# Altium project EPU.PrjPcb
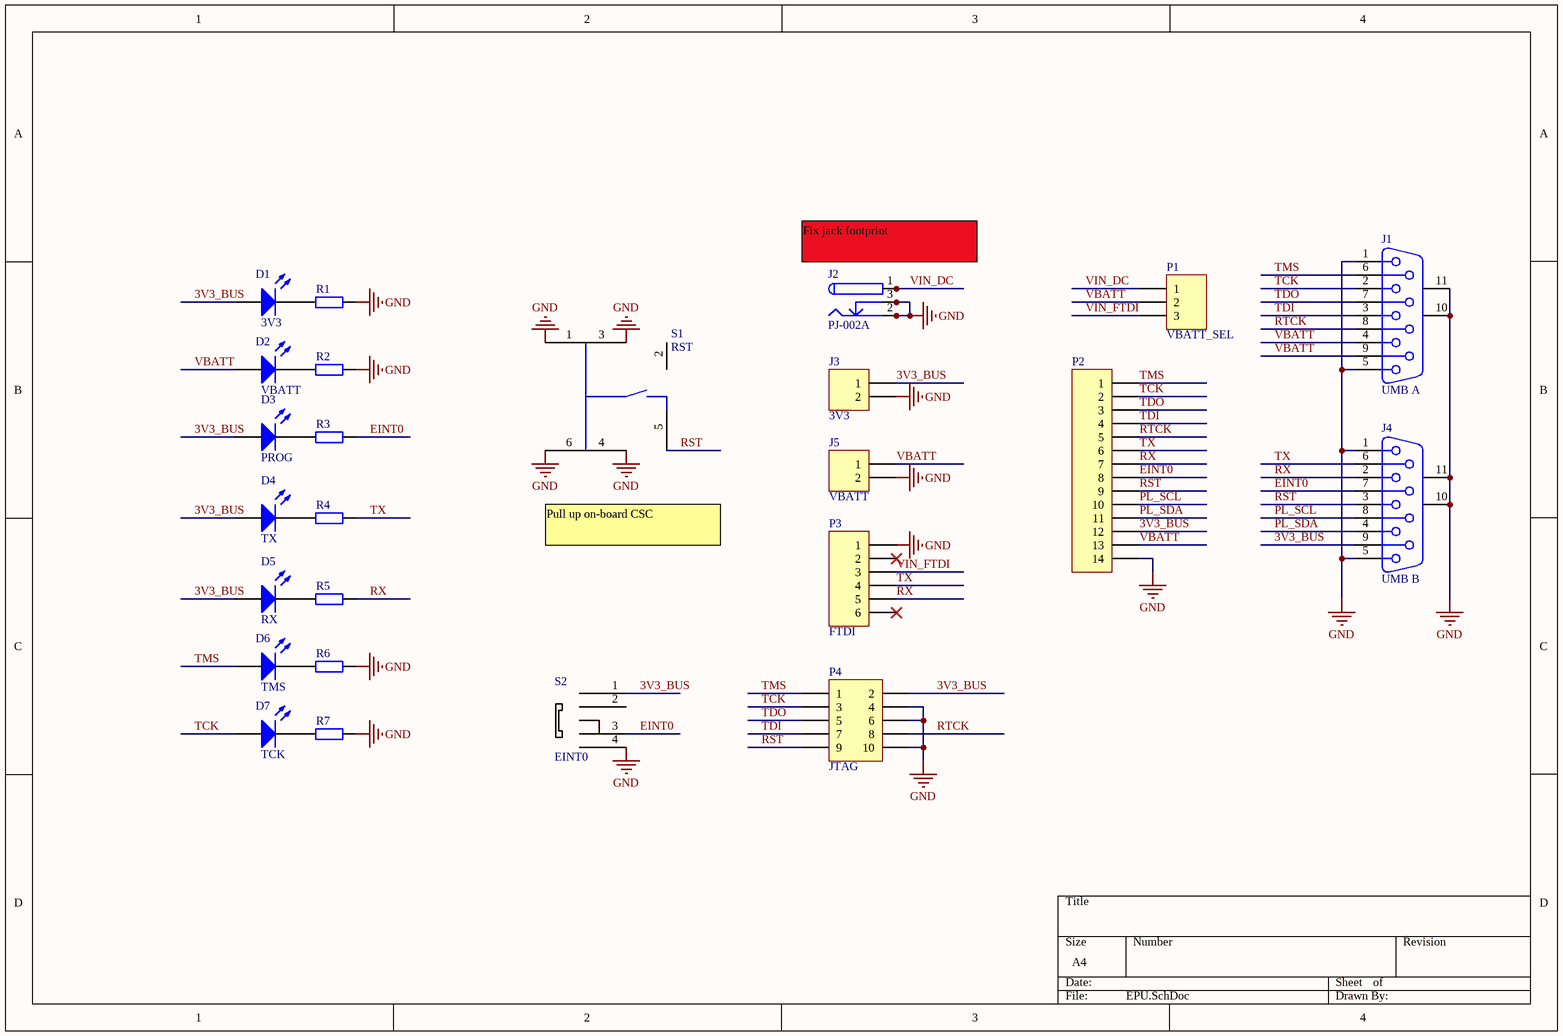
[diagram p0: EPU.SchDoc]
1 sheet, 25 parts. Net scope: global (net labels, ports and power ports of the same name join across sheets).
Board file: EPU.PcbDoc

## Sheet EPU.SchDoc
size A4

### Parts
D1  3V3  [ASMT-Rx45]
D2  VBATT  [ASMT-Rx45]
D3  PROG  [ASMT-Rx45]
D4  TX  [ASMT-Rx45]
D5  RX  [ASMT-Rx45]
D6  TMS  [ASMT-Rx45]
D7  TCK  [ASMT-Rx45]
J1  UMB A  [DSUB1.385-2H9]
J2  PJ-002A  [PJ-002A]
J3  3V3  [5.05mm Terminal Block]
J4  UMB B  [DSUB1.385-2H9]
J5  VBATT  [5.05mm Terminal Block]
P1  VBATT_SEL  [HDR1X3]
P2  (no value)  [HDR1X14]
P3  FTDI  [HDR1X6]
P4  JTAG  [FTSH-105-01-L-DV-TR]
R1  Res3  [0805 Cap]  (value not drawn)
R2  Res3  [0805 Cap]  (value not drawn)
R3  Res3  [0805 Cap]  (value not drawn)
R4  Res3  [0805 Cap]  (value not drawn)
R5  Res3  [0805 Cap]  (value not drawn)
R6  Res3  [0805 Cap]  (value not drawn)
R7  Res3  [0805 Cap]  (value not drawn)
S1  RST  [K5A2]
S2  EINT0  [MILL1300S]

### Nets
GND: J1.1 J1.5 J1.10(MH1) J1.11(MH2) J2.2 J2.2A J2.2B J2.3 J2.3A J2.3B J3.2 J4.1 J4.5 J4.10(MH1) J4.11(MH2) J5.2 P2.14 P3.1 P4.4 P4.6 P4.10 R1.2 R2.2 R6.2 R7.2 S1.1 S1.3 S1.4 S1.6 S2.4
3V3_BUS: D1.1(A) D3.1(A) D4.1(A) D5.1(A) J3.1 J4.9 P2.12 P4.2 S2.1
EINT0: J4.7 P2.8 R3.2 S2.3
PL_SCL: J4.8 P2.10
PL_SDA: J4.4 P2.11
RST: J4.3 P2.9 P4.9 S1.5
RTCK: J1.8 P2.5 P4.8
RX: J4.2 P2.7 P3.5 R5.2
TCK: D7.1(A) J1.2 P2.2 P4.3
TDI: J1.3 P2.4 P4.7
TDO: J1.7 P2.3 P4.5
TMS: D6.1(A) J1.6 P2.1 P4.1
TX: J4.6 P2.6 P3.4 R4.2
VBATT: D2.1(A) J1.4 J1.9 J5.1 P1.2 P2.13
VIN_DC: J2.1 J2.1A J2.1B P1.1
VIN_FTDI: P1.3 P3.3
NetD1_2: D1.2(K) R1.1
NetD2_2: D2.2(K) R2.1
NetD3_2: D3.2(K) R3.1
NetD4_2: D4.2(K) R4.1
NetD5_2: D5.2(K) R5.1
NetD6_2: D6.2(K) R6.1
NetD7_2: D7.2(K) R7.1

Not connected (* = marked no-connect by the designer): P3 2* 6*; S1 2; S2 2

### Notes on the sheet
- (near J2) Fix jack footprint
- Pull up on-board CSC

### Library data of the parts
D1-D7 = LED: Typical INFRARED GaAs LED 0603; Published: 8-Jun-2000; LatestRevisionDate: 08-Jul-2005; LatestRevisionNote: Mech Layer 1 removed.; PackageReference: LED-0; Publisher: Altium Limited; PackageDescription: LED; 2 Leads
J1 J4 = D Connector 9: Receptacle Assembly, 9 Position, Right Angle; PackageDocument: O; Positions: 9; Published: 15-Jun-2001; LatestRevisionDate: 17-Jul-2002; LatestRevisionNote: Re-released for DXP Platform.; DatasheetDocument: 1-Sep-1999; PackageReference: 788750; Publisher: Altium Limited; Orientation: Right Angle; Gender: Receptacle
J2 = PWR2.5: Low Voltage Power Supply Connector; pin to pad: 1A>1 1B>1 2A>2 2B>2 3A>3 3B>3; Published: 17-Dec-2003; DatasheetDocument: 09-May-2002; Publisher: Altium Limited; ComponentLink1Description: Manufacturer Link; ComponentLink1URL: http://domino.kycon.com/internet/Products.html
J3 J5 = Header 2: Header, 2-Pin; LatestRevisionDate: 17-Jul-2002; LatestRevisionNote: Re-released for DXP Platform.; Publisher: Altium Limited
P1 = Header 3: Header, 3-Pin; LatestRevisionDate: 17-Jul-2002; LatestRevisionNote: Re-released for DXP Platform.; Publisher: Altium Limited
P2 = Header 14: Header, 14-Pin; LatestRevisionDate: 17-Jul-2002; LatestRevisionNote: Re-released for DXP Platform.; Publisher: Altium Limited
P3 = Header 6: Header, 6-Pin; LatestRevisionDate: 17-Jul-2002; LatestRevisionNote: Re-released for DXP Platform.; Publisher: Altium Limited
P4 = Header 5X2: Header, 5-Pin, Dual row; LatestRevisionDate: 17-Jul-2002; LatestRevisionNote: Re-released for DXP Platform.; Publisher: Altium Limited
R1-R7 = Res3: Resistor; Value: 1K; Published: 8-Jun-2000; LatestRevisionDate: 29-May-2009; LatestRevisionNote: IPC-7351 Footprint Added.; PackageReference: J1-0603; Publisher: Altium Limited; PackageDescription: Chip Resistor
S1 = KS2A: Tact Switch
S2 = MLL1300S: Slide switch SP3T switch